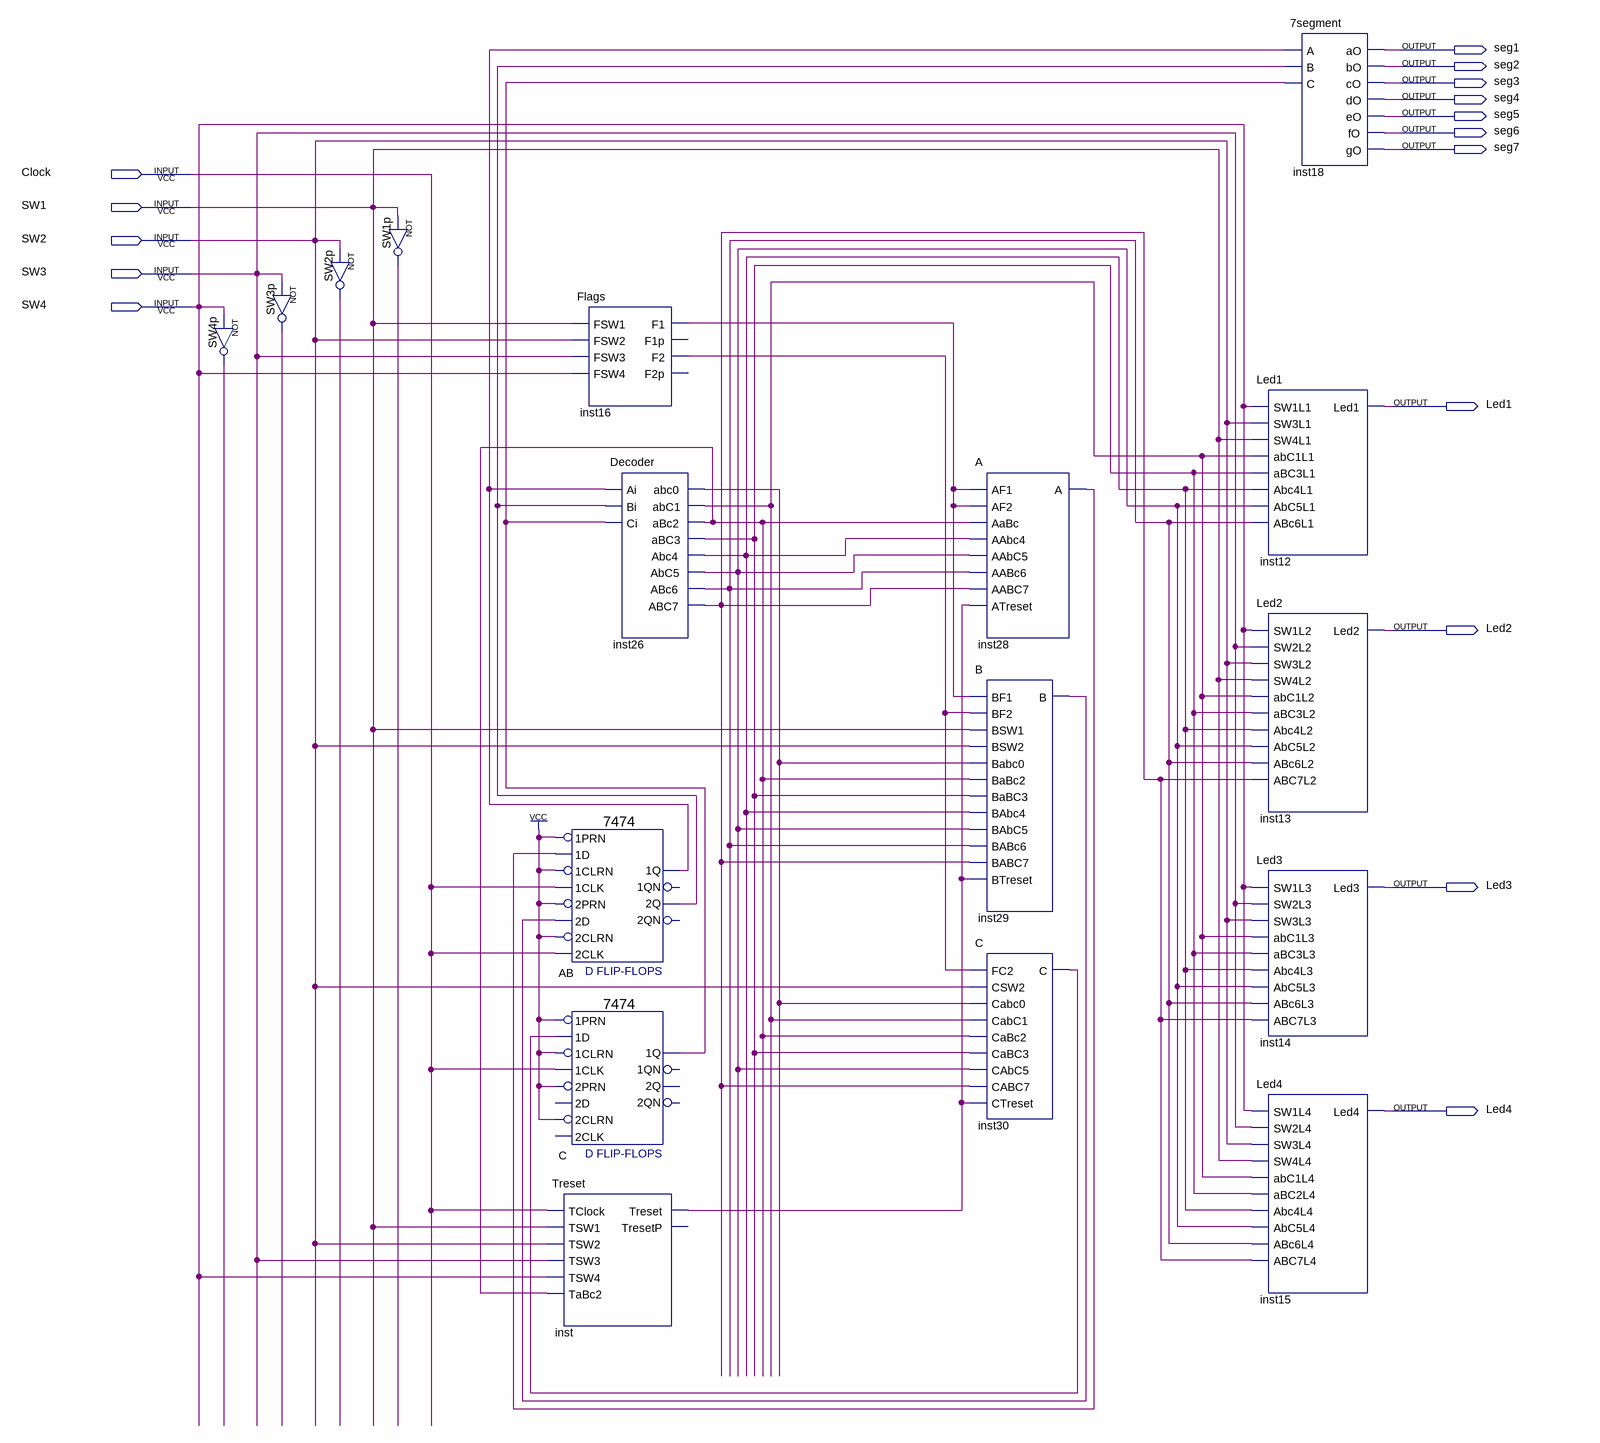
[diagram p0: schematic sheet]
// Quartus schematic SequenceDetector.bdf as structural Verilog: 17 symbols, 16 pins
module SequenceDetector (
  input  Clock,
  input  SW1,
  input  SW2,
  input  SW3,
  input  SW4,
  output seg1,
  output seg2,
  output seg3,
  output seg4,
  output seg5,
  output seg6,
  output seg7,
  output Led1,
  output Led2,
  output Led3,
  output Led4
);

  wire AB_1q, AB_2q, C_1q, inst16_f1, inst16_f2, inst26_abc0, inst26_abc1, inst26_abc2, inst26_abc3,
       inst26_abc4, inst26_abc5, inst26_abc6, inst26_abc7, inst28_a, inst29_b, inst30_c, inst_treset,
       SW1p_out, SW2p_out, SW3p_out, SW4p_out;

  not SW4p (SW4p_out, SW4);
  not SW3p (SW3p_out, SW3);
  not SW1p (SW1p_out, SW1);
  not SW2p (SW2p_out, SW2);
  Flags inst16 (.FSW1(SW1), .FSW2(SW2), .FSW3(SW3), .FSW4(SW4), .F1(inst16_f1), .F2(inst16_f2));  // open: F1p, F2p
  \7474  AB (
    .\2D (inst29_b), .\2PRN (1'b1), .\1CLK (Clock), .\1D (inst28_a), .\1PRN (1'b1), .\2CLK (Clock),
    .\2CLRN (1'b1), .\1CLRN (1'b1), .\2Q (AB_2q), .\1Q (AB_1q));  // open: 1QN, 2QN
  \7474  C (
    .\2PRN (1'b1), .\1CLK (Clock), .\1D (inst30_c), .\1PRN (1'b1), .\2CLRN (1'b1), .\1CLRN (1'b1), .\1Q (C_1q));  // open: 2D, 2CLK, 1QN, 2Q, 2QN
  Treset inst (
    .TClock(Clock), .TSW1(SW1), .TSW2(SW2), .TSW3(SW3), .TSW4(SW4), .TaBc2(inst26_abc2), .Treset(inst_treset));  // open: TresetP
  Decoder inst26 (
    .Ai(AB_1q), .Bi(AB_2q), .Ci(C_1q), .abc0(inst26_abc0), .abC1(inst26_abc1), .aBc2(inst26_abc2),
    .aBC3(inst26_abc3), .Abc4(inst26_abc4), .AbC5(inst26_abc5), .ABc6(inst26_abc6), .ABC7(inst26_abc7));
  A inst28 (
    .AF1(inst16_f1), .AF2(inst16_f1), .AaBc(inst26_abc2), .AAbc4(inst26_abc4), .AAbC5(inst26_abc5),
    .AABc6(inst26_abc6), .AABC7(inst26_abc7), .ATreset(inst_treset), .A(inst28_a));
  B inst29 (
    .BF1(inst16_f1), .BF2(inst16_f2), .BSW1(SW1), .BSW2(SW2), .Babc0(inst26_abc0), .BaBc2(inst26_abc2),
    .BaBC3(inst26_abc3), .BAbc4(inst26_abc4), .BAbC5(inst26_abc5), .BABc6(inst26_abc6), .BABC7(inst26_abc7),
    .BTreset(inst_treset), .B(inst29_b));
  C inst30 (
    .FC2(inst16_f2), .CSW2(SW2), .Cabc0(inst26_abc0), .CabC1(inst26_abc1), .CaBc2(inst26_abc2),
    .CaBC3(inst26_abc3), .CAbC5(inst26_abc5), .CABC7(inst26_abc7), .CTreset(inst_treset), .C(inst30_c));
  \7segment  inst18 (
    .A(AB_1q), .B(AB_2q), .C(C_1q), .aO(seg1), .bO(seg2), .cO(seg3), .dO(seg4), .eO(seg5), .fO(seg6),
    .gO(seg7));
  Led1 inst12 (
    .SW1L1(SW4), .SW3L1(SW2), .SW4L1(SW1), .abC1L1(inst26_abc1), .aBC3L1(inst26_abc3), .Abc4L1(inst26_abc4),
    .AbC5L1(inst26_abc5), .ABc6L1(inst26_abc6), .Led1(Led1));
  Led2 inst13 (
    .SW1L2(SW4), .SW2L2(SW3), .SW3L2(SW2), .SW4L2(SW1), .abC1L2(inst26_abc1), .aBC3L2(inst26_abc3),
    .Abc4L2(inst26_abc4), .AbC5L2(inst26_abc5), .ABc6L2(inst26_abc6), .ABC7L2(inst26_abc7), .Led2(Led2));
  Led3 inst14 (
    .SW1L3(SW4), .SW2L3(SW3), .SW3L3(SW2), .abC1L3(inst26_abc1), .aBC3L3(inst26_abc3), .Abc4L3(inst26_abc4),
    .AbC5L3(inst26_abc5), .ABc6L3(inst26_abc6), .ABC7L3(inst26_abc7), .Led3(Led3));
  Led4 inst15 (
    .SW1L4(SW4), .SW2L4(SW3), .SW3L4(SW2), .SW4L4(SW1), .abC1L4(inst26_abc1), .aBC2L4(inst26_abc3),
    .Abc4L4(inst26_abc4), .AbC5L4(inst26_abc5), .ABc6L4(inst26_abc6), .ABC7L4(inst26_abc7), .Led4(Led4));
endmodule
